# Altium schematic sheet MCU.SchDoc: Microcontroller
size A4; DrawnBy: A. Küllenberg; Revision: A; SheetNumber: 5; SheetTotal: 10
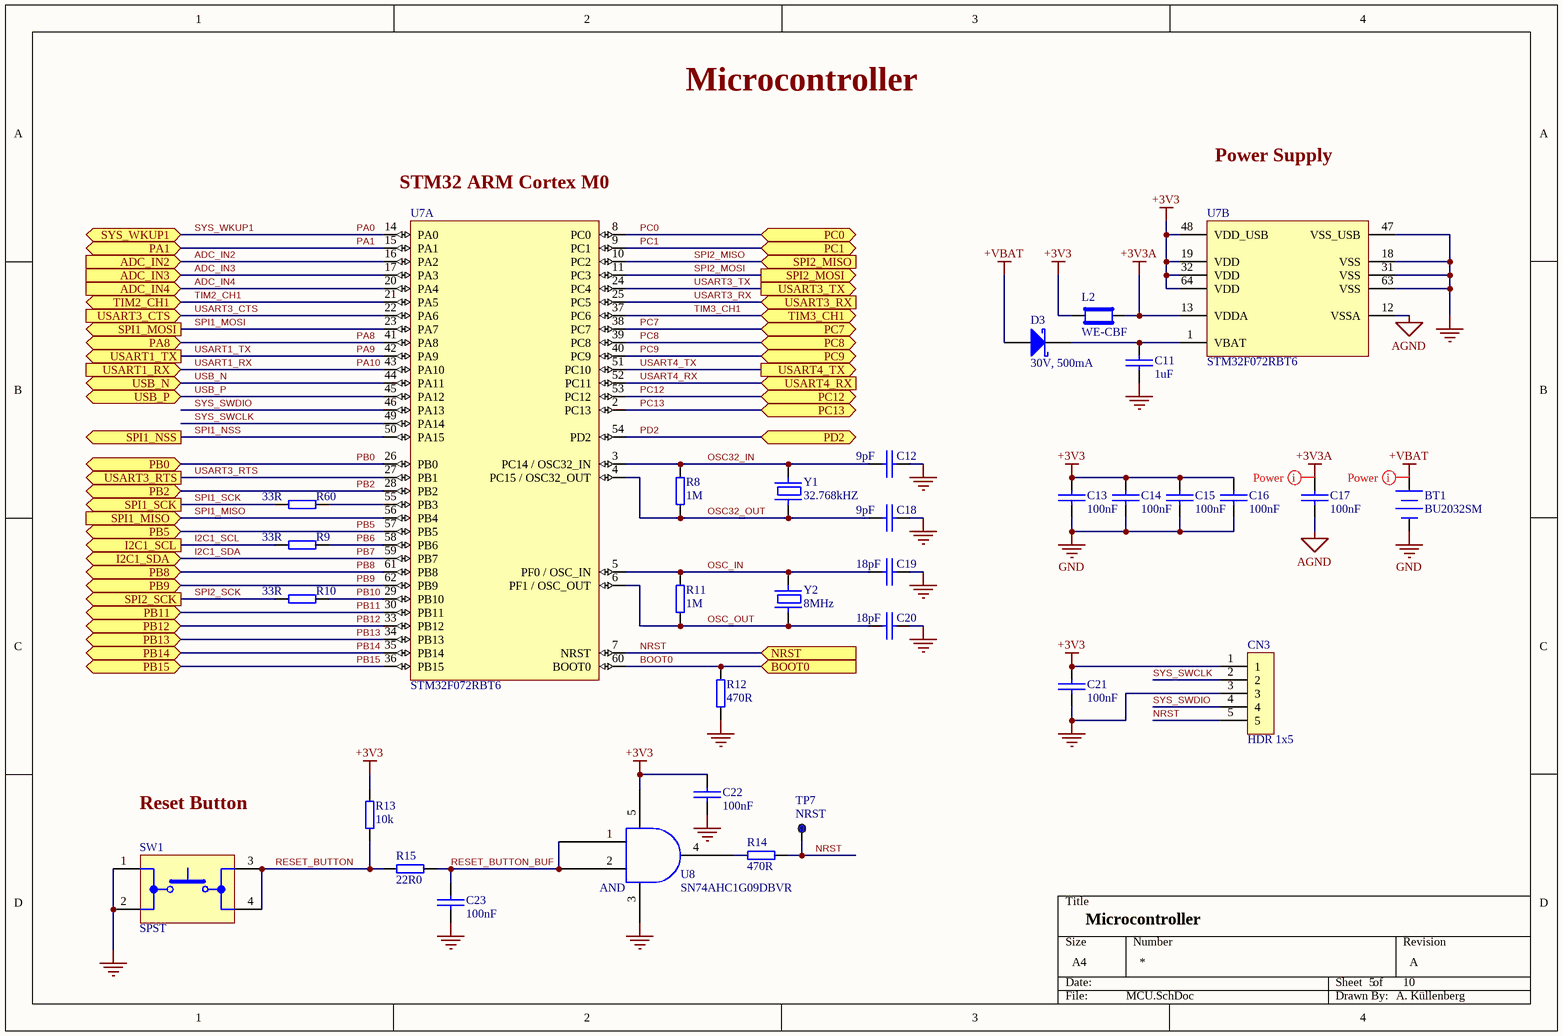
[diagram p0: MCU.SchDoc]

## Parts
BT1  BU2032SM  [BU2032SM]
C11  1uF  [C0603]
C12  9pF  [C0603]
C13  100nF  [C0603]
C14  100nF  [C0603]
C15  100nF  [C0603]
C16  100nF  [C0603]
C17  100nF  [C0603]
C18  9pF  [C0603]
C19  18pF  [C0603]
C20  18pF  [C0603]
C21  100nF  [C0603]
C22  100nF  [C0603]
C23  100nF  [C0603]
CN3  HDR 1x5  [PREC005SAAN-RC]
D3  30V, 500mA  [SOD523_N]
L2  WE-CBF  [L0603]
R8  1M  [R0603]
R9  33R  [R0402]
R10  33R  [R0402]
R11  1M  [R0603]
R12  470R  [R0402]
R13  10k  [R0603]
R14  470R  [R0603]
R15  22R0  [R0603]
R60  33R  [R0402]
SW1  SPST  [1825910-6]
TP7  NRST  [TP_1mm]  (no BOM)
U7  STM32F072RBT6  [LQFP64]  (parts A,B of 2)
U8  SN74AHC1G09DBVR  [SOT23-5]
Y1  32.768kHZ  [ABS07AIG]
Y2  8MHz  [ABM7_v1_1_BIG]

## Ports
ADC_IN2 (in), ADC_IN3 (in), ADC_IN4 (in), BOOT0 (in), I2C1_SCL (out), I2C1_SDA (bidir), NRST (in), PA1 (bidir), PA8 (bidir), PB0 (bidir), PB2 (bidir), PB5 (bidir), PB8 (bidir), PB9 (bidir), PB11 (bidir), PB12 (bidir), PB13 (bidir), PB14 (bidir), PB15 (bidir), PC0 (bidir), PC1 (bidir), PC7 (bidir), PC8 (bidir), PC9 (bidir), PC12 (bidir), PC13 (bidir), PD2 (bidir), SPI1_MISO (in), SPI1_MOSI (out), SPI1_NSS (out), SPI1_SCK (out), SPI2_MISO (in), SPI2_MOSI (out), SPI2_SCK (out), SYS_WKUP1 (bidir), TIM2_CH1 (bidir), TIM3_CH1 (bidir), USART1_RX (in), USART1_TX (out), USART3_CTS (in), USART3_RTS (out), USART3_RX (in), USART3_TX (out), USART4_RX (in), USART4_TX (out), USB_N (bidir), USB_P (bidir)

## Nets
+3V3: C13.2 C14.2 C15.2 C16.2 C21.2 C22.2 CN3.1 L2.1 R13.2 U7.19(VDD) U7.32(VDD) U7.48(VDD_USB) U7.64(VDD) U8.5
+3V3A: C17.2 L2.2 U7.13(VDDA)
+VBAT: BT1.1(+) D3.1(A)
AGND: C17.1 U7.12(VSSA)
GND: BT1.2(-) C11.1 C12.2 C13.1 C14.1 C15.1 C16.1 C18.2 C19.2 C20.2 C21.1 C22.1 C23.1 CN3.3 R12.1 SW1.1 SW1.2 U7.18(VSS) U7.31(VSS) U7.47(VSS_USB) U7.63(VSS) U8.3
ADC_IN2: U7.16(PA2) ; port ADC_IN2
ADC_IN3: U7.17(PA3) ; port ADC_IN3
ADC_IN4: U7.20(PA4) ; port ADC_IN4
BOOT0: R12.2 U7.60(BOOT0) ; port BOOT0
I2C1_SCL: R9.1 ; port I2C1_SCL
I2C1_SDA: U7.59(PB7) ; port I2C1_SDA  [also labelled PB7]
NRST: CN3.5 R14.2 TP7.1 U7.7(NRST) ; port NRST
OSC32_IN: C12.1 R8.2 U7.3(PC14_/_OSC32_IN) Y1.2
OSC32_OUT: C18.1 R8.1 U7.4(PC15_/_OSC32_OUT) Y1.1
OSC_IN: C19.1 R11.2 U7.5(PF0_/_OSC_IN) Y2.2
OSC_OUT: C20.1 R11.1 U7.6(PF1_/_OSC_OUT) Y2.1
PA0: U7.14(PA0) ; port SYS_WKUP1  [also labelled SYS_WKUP1]
PA1: U7.15(PA1) ; port PA1
PA8: U7.41(PA8) ; port PA8
PA9: U7.42(PA9) ; port USART1_TX  [also labelled USART1_TX]
PA10: U7.43(PA10) ; port USART1_RX  [also labelled USART1_RX]
PB0: U7.26(PB0) ; port PB0
PB2: U7.28(PB2) ; port PB2
PB5: U7.57(PB5) ; port PB5
PB6: R9.2 U7.58(PB6)
PB8: U7.61(PB8) ; port PB8
PB9: U7.62(PB9) ; port PB9
PB10: R10.2 U7.29(PB10)
PB11: U7.30(PB11) ; port PB11
PB12: U7.33(PB12) ; port PB12
PB13: U7.34(PB13) ; port PB13
PB14: U7.35(PB14) ; port PB14
PB15: U7.36(PB15) ; port PB15
PC0: U7.8(PC0) ; port PC0
PC1: U7.9(PC1) ; port PC1
PC7: U7.38(PC7) ; port PC7
PC8: U7.39(PC8) ; port PC8
PC9: U7.40(PC9) ; port PC9
PC12: U7.53(PC12) ; port PC12
PC13: U7.2(PC13) ; port PC13
PD2: U7.54(PD2) ; port PD2
RESET_BUTTON: R13.1 R15.1 SW1.3 SW1.4
RESET_BUTTON_BUF: C23.2 R15.2 U8.1 U8.2
SPI1_MISO: U7.56(PB4) ; port SPI1_MISO
SPI1_MOSI: U7.23(PA7) ; port SPI1_MOSI
SPI1_NSS: U7.50(PA15) ; port SPI1_NSS
SPI1_SCK: R60.1 ; port SPI1_SCK
SPI2_MISO: U7.10(PC2) ; port SPI2_MISO
SPI2_MOSI: U7.11(PC3) ; port SPI2_MOSI
SPI2_SCK: R10.1 ; port SPI2_SCK
SYS_SWCLK: CN3.2 U7.49(PA14)
SYS_SWDIO: CN3.4 U7.46(PA13)
TIM2_CH1: U7.21(PA5) ; port TIM2_CH1
TIM3_CH1: U7.37(PC6) ; port TIM3_CH1
USART3_CTS: U7.22(PA6) ; port USART3_CTS
USART3_RTS: U7.27(PB1) ; port USART3_RTS
USART3_RX: U7.25(PC5) ; port USART3_RX
USART3_TX: U7.24(PC4) ; port USART3_TX
USART4_RX: U7.52(PC11) ; port USART4_RX
USART4_TX: U7.51(PC10) ; port USART4_TX
USB_N: U7.44(PA11) ; port USB_N
USB_P: U7.45(PA12) ; port USB_P
NetC11_2: C11.2 D3.2(K) U7.1(VBAT)
NetR14_1: R14.1 U8.4
NetR60_2: R60.2 U7.55(PB3)

## Layout directives
net class Power: +3V3A, +VBAT

## Notes on the sheet
- Microcontroller
- Power Supply
- (near U7) STM32 ARM Cortex M0
- Reset Button
- (in symbol SN74AHC1G09DBVR) AND

## Library data of the parts
BT1 = BU2032SM-BT-GTR: HOLDER CR2032 GOLD LEADS SMD; Manufacturer: MPD (Memory Protection Devices); Battery Type, Function: Coin Cell, Holder; Style: Holder (Open); Battery Cell Size: Coin, 20.0mm; Number of Cells: 1; Battery Series: 2032; Published: 24-Mar-1999; LatestRevisionDate: 17-Jul-2002; LatestRevisionNote: Re-released for DXP Platform.; PackageReference: BAT-2; Publisher: Altium Limited; PackageDescription: Battery; 2 Leads; Part Number: BU2032SM-BT-GTR; Value: BU2032SM; Supplier 1: Digi-Key; Supplier Part Number 1: BU2032SM-BT-GCT-ND; Manufacturer Part Number: BU2032SM-BT-GTR; RoHS: RoHS Compliant; Category: Battery Products; Stock 1: 216128; Pricing 1: 1=0.71, 10=0.651, 100=0.5914 (EUR); Part Status: Active; Mounting Type: PCB, Surface Mount; Termination Style: SMD (SMT) Tab; Height Above Board: 0.205" (5.20mm); Operating Temperature: -40°C ~ 280°C; ComponentLink1URL: http://www.memoryprotectiondevices.com/datasheets/BU2032SM-BT-GTR-datasheet.pdf; ComponentLink1Description: http://www.memoryprotectiondevices.com/datasheets/BU2032SM-BT-GTR-datasheet.pdf
C11 = GCM188R71E105KA64D: CAP CER 1UF 25V X7R 0603; Manufacturer: Murata Electronics North America; Capacitance: 1µF; Tolerance: ±10%; Part Number: GCM188R71E105KA64D; Value: 1uF; Supplier 1: Digi-Key; Supplier Part Number 1: 490-10673-1-ND; Manufacturer Part Number: GCM188R71E105KA64D; RoHS: RoHS Compliant; Category: Capacitors; Stock 1: 53908; Pricing 1: 1=0.19, 10=0.13, 50=0.0748, 100=0.0617, 250=0.05196, 500=0.04352, 1000=0.03572 (EUR); Packaging: Cut Tape (CT); Voltage - Rated: 25V; Temperature Coefficient: X7R; Mounting Type: Surface Mount, MLCC; Operating Temperature: -55°C ~ 125°C; Applications: Automotive; Ratings: AEC-Q200; Package / Case: 0603 (1608 Metric); Size / Dimension: 0.063" L x 0.031" W (1.60mm x 0.80mm); Height - Seated (Max): -; Thickness (Max): 0.035" (0.90mm); Lead Spacing: -; Features: -; Lead Style: -; ComponentLink1URL: http://www.murata.com/~/media/webrenewal/support/library/catalog/products/capacitor/mlcc/c03e.ashx; ComponentLink1Description: http://www.murata.com/~/media/webrenewal/support/library/catalog/products/capacitor/mlcc/c03e.ashx
C12 C18 = CL10C090DB8NNNC: CAP CER 9PF 50V NP0 0603; Manufacturer: Samsung Electro-Mechanics America, Inc.; Tolerance: ±0.5pF; Temperature Coefficient: C0G, NP0; Part Number: CL10C090DB8NNNC; Value: 9pF; Supplier 1: Digi-Key; Supplier Part Number 1: 1276-2143-1-ND; Manufacturer Part Number: CL10C090DB8NNNC; RoHS: RoHS Compliant; Category: Capacitors; Stock 1: 4204; Pricing 1: 1=0.09, 10=0.034, 25=0.0244, 50=0.0184, 100=0.015, 250=0.01256, 500=0.01072, 1000=0.00842 (EUR); Packaging: Cut Tape (CT); Capacitance: 9pF; Voltage - Rated: 50V; Mounting Type: Surface Mount, MLCC; Operating Temperature: -55°C ~ 125°C; Applications: General Purpose; Ratings: -; Package / Case: 0603 (1608 Metric); Size / Dimension: 0.063" L x 0.031" W (1.60mm x 0.80mm); Height - Seated (Max): -; Thickness (Max): 0.035" (0.90mm); Lead Spacing: -; Features: -; Lead Style: -; ComponentLink1URL: http://www.samsungsem.com/kr/support/product-search/mlcc/__icsFiles/afieldfile/2016/08/18/S_CL10C090DB8NNNC.pdf; ComponentLink1Description: http://www.samsungsem.com/kr/support/product-search/mlcc/__icsFiles/afieldfile/2016/08/18/S_CL10C090DB8NNNC.pdf; Part Status: Active
C13-C17 C21-C23 = C0603C104K5RACTU: CAP CER 0.1UF 50V X7R 0603; Manufacturer: Kemet; Capacitance: 0.10µF; Tolerance: ±10%; Part Number: C0603C104K5RACTU; Value: 100nF; Supplier 1: Digi-Key; Supplier Part Number 1: 399-5089-1-ND; Manufacturer Part Number: C0603C104K5RACTU; RoHS: RoHS Compliant; Category: Capacitors; Stock 1: 1628757; Pricing 1: 1=0.09, 10=0.037, 50=0.0198, 100=0.0167, 250=0.01372, 500=0.01174, 1000=0.00914 (EUR); Packaging: Cut Tape (CT); Voltage - Rated: 50V; Temperature Coefficient: X7R; Mounting Type: Surface Mount, MLCC; Operating Temperature: -55°C ~ 125°C; Applications: General Purpose; Ratings: -; Package / Case: 0603 (1608 Metric); Size / Dimension: 0.063" L x 0.031" W (1.60mm x 0.80mm); Height - Seated (Max): -; Thickness (Max): 0.034" (0.87mm); Lead Spacing: -; Features: -; Lead Style: -; ComponentLink1URL: http://www.kemet.com/docfinder?Partnumber=C0603C104K5RACTU; ComponentLink1Description: http://www.kemet.com/docfinder?Partnumber=C0603C104K5RACTU
C19 C20 = CL10C180JB8NNNC: CAP CER 18PF 50V NP0 0603; Manufacturer: Samsung Electro-Mechanics America, Inc.; Tolerance: ±5%; Temperature Coefficient: C0G, NP0; Part Number: CL10C180JB8NNNC; Value: 18pF; Supplier 1: Digi-Key; Supplier Part Number 1: 1276-1089-1-ND; Manufacturer Part Number: CL10C180JB8NNNC; RoHS: RoHS Compliant; Category: Capacitors; Stock 1: 270357; Pricing 1: 1=0.09, 10=0.027, 25=0.02, 50=0.015, 100=0.0122, 250=0.01016, 500=0.00866, 1000=0.00682 (EUR); Packaging: Cut Tape (CT); Capacitance: 18pF; Voltage - Rated: 50V; Mounting Type: Surface Mount, MLCC; Operating Temperature: -55°C ~ 125°C; Applications: General Purpose; Ratings: -; Package / Case: 0603 (1608 Metric); Size / Dimension: 0.063" L x 0.031" W (1.60mm x 0.80mm); Height - Seated (Max): -; Thickness (Max): 0.035" (0.90mm); Lead Spacing: -; Features: -; Lead Style: -; ComponentLink1URL: http://www.samsungsem.com/kr/support/product-search/mlcc/__icsFiles/afieldfile/2016/08/18/S_CL10C180JB8NNNC.pdf; ComponentLink1Description: http://www.samsungsem.com/kr/support/product-search/mlcc/__icsFiles/afieldfile/2016/08/18/S_CL10C180JB8NNNC.pdf; Part Status: Active
CN3 = PREC005SAAN-RC: CONN HEADER .100" SNGL STR 5POS; Manufacturer: Sullins Connector Solutions; Connector Type: Header, Breakaway; Number of Positions: 5; Number of Positions Loaded: All; Current Rating: 3A per Contact; Pitch - Mating: 0.100" (2.54mm); Shrouding: Unshrouded; Contact Length - Mating: 0.230" (5.84mm); Style: Board to Board or Cable; Contact Length - Post: 0.120" (3.05mm); Overall Contact Length: 0.448" (11.39mm); Material Flammability Rating: UL94 V-0; Part Number: PREC005SAAN-RC; Value: HDR 1x5; Supplier 1: Digi-Key; Supplier Part Number 1: S1012EC-05-ND; Manufacturer Part Number: PREC005SAAN-RC; RoHS: RoHS Compliant; Category: Connectors, Interconnects; Stock 1: 1812; Pricing 1: 1=0.15, 10=0.137, 100=0.1124, 500=0.08882, 1000=0.07626, 5000=0.06957, 10000=0.06689 (EUR); Packaging: Bulk; Contact Type: Male Pin; Number of Rows: 1; Mounting Type: Through Hole; Termination: Solder; Fastening Type: -; Features: -; ComponentLink1URL: http://media.digikey.com/PDF/Data%20Sheets/Sullins%20PDFs/z%20RzCzzzSzzN-RC,%20ST,11635-B.pdf; ComponentLink1Description: http://media.digikey.com/PDF/Data%20Sheets/Sullins%20PDFs/z%20RzCzzzSzzN-RC,%20ST,11635-B.pdf; Voltage Rating: -; Contact Material: Brass; Operating Temperature: -40°C ~ 105°C; Part Status: Active; Row Spacing - Mating: -; Contact Finish - Mating: Tin; Contact Finish Thickness - Mating: -; Insulation Color: Black; Insulation Height: 0.098" (2.50mm); Contact Shape: Square; Ingress Protection: -; Contact Finish - Post: Tin; Insulation Material: Polybutylene Terephthalate (PBT); Mated Stacking Heights: -; Contact Finish Thickness - Post: -; Applications: -
D3 = BAS 3005B-02V H6327: DIODE SCHOTTKY 30V 500MA SC79-2; Manufacturer: Infineon Technologies; Current - Reverse Leakage @ Vr: 25µA @ 30V; Voltage - Forward (Vf) (Max) @ If: 620mV @ 500mA; Current - Average Rectified (Io): 500mA (DC); Speed: Fast Recovery =< 500ns, > 200mA (Io); Capacitance @ Vr, F: 10pF @ 5V, 1MHz; Part Number: BAS 3005B-02V H6327; Value: 30V, 500mA; Supplier 1: Digi-Key; Supplier Part Number 1: BAS 3005B-02V H6327CT-ND; Manufacturer Part Number: BAS 3005B-02V H6327; RoHS: RoHS Compliant; Category: Discrete Semiconductor Products; Stock 1: 33141; Pricing 1: 1=0.34, 10=0.26, 100=0.1619, 500=0.11066, 1000=0.08507 (EUR); Packaging: Cut Tape (CT); Mounting Type: Surface Mount; Package / Case: SC-79, SOD-523; Supplier Device Package: PG-SC79-2; ComponentLink1URL: http://www.infineon.com/dgdl/Infineon-BAS3005B-DS-v01_01-en.pdf?fileId=db3a30432d9b3066012db880a14b0bc1; ComponentLink1Description: http://www.infineon.com/dgdl/Infineon-BAS3005B-DS-v01_01-en.pdf?fileId=db3a30432d9b3066012db880a14b0bc1; Diode Type: Schottky; Voltage - DC Reverse (Vr) (Max): 30V; Reverse Recovery Time (trr): -; Operating Temperature - Junction: -55°C ~ 125°C
L2 = 742792651: FERRITE BEAD 600 OHM 0603 1LN; Manufacturer: Wurth Electronics Inc.; Filter Type: Signal Line; Number of Lines: 1; Impedance @ Frequency: 600 Ohm @ 100MHz; Current Rating (Max): 1A; DC Resistance (DCR) (Max): 200 mOhm; Part Number: 742792651; Value: WE-CBF; Supplier 1: Digi-Key; Supplier Part Number 1: 732-1593-1-ND; Manufacturer Part Number: 742792651; RoHS: RoHS Compliant; Category: Filters; Stock 1: 99870; Pricing 1: 1=0.22, 10=0.185, 50=0.1806, 100=0.1667, 1000=0.15164 (EUR); Packaging: Cut Tape (CT); Part Status: Active; Ratings: -; Operating Temperature: -55°C ~ 125°C; Package / Case: 0603 (1608 Metric); Mounting Type: Surface Mount; Height (Max): 0.039" (1.00mm); Size / Dimension: 0.063" L x 0.031" W (1.60mm x 0.80mm); ComponentLink1URL: http://katalog.we-online.de/pbs/datasheet/742792651.pdf; ComponentLink1Description: http://katalog.we-online.de/pbs/datasheet/742792651.pdf
R8 R11 = RC0603FR-071ML: RES SMD 1M OHM 1% 1/10W 0603; Manufacturer: Yageo; Power (Watts): 0.1W, 1/10W; Temperature Coefficient: ±100ppm/°C; Part Number: RC0603FR-071ML; Value: 1M; Manufacturer Part Number: RC0603FR-071ML; RoHS: RoHS Compliant; Category: Resistors; Stock 1: 3055845; Pricing 1: 1=0.09, 10=0.012, 25=0.0088, 50=0.0066, 100=0.0049, 250=0.00372, 500=0.00298, 1000=0.0022 (EUR); Packaging: Cut Tape (CT); Resistance (Ohms): 1M; Tolerance: ±1%; Composition: Thick Film; Features: Moisture Resistant; Operating Temperature: -55°C ~ 155°C; Package / Case: 0603 (1608 Metric); Supplier Device Package: 0603; Size / Dimension: 0.063" L x 0.031" W (1.60mm x 0.80mm); ComponentLink1URL: http://www.yageo.com/documents/recent/PYu-RC_Group_51_RoHS_L_7.pdf; ComponentLink1Description: http://www.yageo.com/documents/recent/PYu-RC_Group_51_RoHS_L_7.pdf; Supplier 1: Digi-Key; Supplier Part Number 1: 311-1.00MHRCT-ND; Height - Seated (Max): 0.022" (0.55mm); Part Status: Active; Failure Rate: -
R9 R10 R60 = RC0402FR-0733RL: RES SMD 33 OHM 1% 1/16W 0402; Manufacturer: Yageo; Resistance (Ohms): 33; Power (Watts): 0.063W, 1/16W; Temperature Coefficient: ±100ppm/°C; Part Number: RC0402FR-0733RL; Value: 33R; Manufacturer Part Number: RC0402FR-0733RL; RoHS: RoHS Compliant; Category: Resistors; Stock 1: 1076015; Pricing 1: 1=0.09, 10=0.012, 100=0.005, 1000=0.00222, 2500=0.00193, 5000=0.00159 (EUR); Packaging: Cut Tape (CT); Tolerance: ±1%; Composition: Thick Film; Features: Moisture Resistant; Operating Temperature: -55°C ~ 155°C; Package / Case: 0402 (1005 Metric); Supplier Device Package: 0402; Size / Dimension: 0.039" L x 0.020" W (1.00mm x 0.50mm); ComponentLink1URL: http://www.yageo.com/documents/recent/PYu-RC_Group_51_RoHS_L_7.pdf; ComponentLink1Description: http://www.yageo.com/documents/recent/PYu-RC_Group_51_RoHS_L_7.pdf; Supplier 1: Digi-Key; Supplier Part Number 1: 311-33.0LRCT-ND; Height - Seated (Max): 0.016" (0.40mm); Part Status: Active; Failure Rate: -
R12 = RC0402FR-07470RL: RES SMD 470 OHM 1% 1/16W 0402; Manufacturer: Yageo; Resistance (Ohms): 470; Power (Watts): 0.063W, 1/16W; Temperature Coefficient: ±100ppm/°C; Part Number: RC0402FR-07470RL; Value: 470R; Manufacturer Part Number: RC0402FR-07470RL; RoHS: RoHS Compliant; Category: Resistors; Stock 1: 625757; Pricing 1: 1=0.09, 10=0.012, 100=0.005, 1000=0.00222, 2500=0.00193, 5000=0.00159 (EUR); Packaging: Cut Tape (CT); Tolerance: ±1%; Composition: Thick Film; Features: Moisture Resistant; Operating Temperature: -55°C ~ 155°C; Package / Case: 0402 (1005 Metric); Supplier Device Package: 0402; Size / Dimension: 0.039" L x 0.020" W (1.00mm x 0.50mm); ComponentLink1URL: http://www.yageo.com/documents/recent/PYu-RC_Group_51_RoHS_L_7.pdf; ComponentLink1Description: http://www.yageo.com/documents/recent/PYu-RC_Group_51_RoHS_L_7.pdf; Supplier 1: Digi-Key; Supplier Part Number 1: 311-470LRCT-ND; Height - Seated (Max): 0.016" (0.40mm); Part Status: Active; Failure Rate: -
R13 = RC0603FR-0710KL: RES SMD 10K OHM 1% 1/10W 0603; Manufacturer: Yageo; Power (Watts): 0.1W, 1/10W; Temperature Coefficient: ±100ppm/°C; Part Number: RC0603FR-0710KL; Value: 10k; Manufacturer Part Number: RC0603FR-0710KL; RoHS: RoHS Compliant; Category: Resistors; Stock 1: 14298796; Pricing 1: 1=0.09, 10=0.012, 25=0.0088, 50=0.007, 100=0.0051, 250=0.00388, 500=0.0031, 1000=0.00229 (EUR); Packaging: Cut Tape (CT); Resistance (Ohms): 10k; Tolerance: ±1%; Composition: Thick Film; Features: Moisture Resistant; Operating Temperature: -55°C ~ 155°C; Package / Case: 0603 (1608 Metric); Supplier Device Package: 0603; Size / Dimension: 0.063" L x 0.031" W (1.60mm x 0.80mm); ComponentLink1URL: http://www.yageo.com/documents/recent/PYu-RC_Group_51_RoHS_L_7.pdf; ComponentLink1Description: http://www.yageo.com/documents/recent/PYu-RC_Group_51_RoHS_L_7.pdf; Supplier 1: Digi-Key; Supplier Part Number 1: 311-10.0KHRCT-ND; Height - Seated (Max): 0.022" (0.55mm); Part Status: Active; Failure Rate: -
R14 = 470R: RES SMD 470 OHM 1% 1/10W 0603; Manufacturer: Yageo; Manufacturer Part Number: RC0603FR-07470RL; Resistance (Ohms): 470; Power (Watts): 0.1W, 1/10W; Temperature Coefficient: ±100ppm/°C; Part Number: 470R; Value: 470R; RoHS: RoHS Compliant; Category: Resistors; Stock 1: 2060115; Pricing 1: 1=0.09, 10=0.012, 25=0.0088, 50=0.0066, 100=0.0049, 250=0.00372, 500=0.00298, 1000=0.0022 (EUR); Packaging: Cut Tape (CT); Tolerance: ±1%; Composition: Thick Film; Features: Moisture Resistant; Operating Temperature: -55°C ~ 155°C; Package / Case: 0603 (1608 Metric); Supplier Device Package: 0603; Size / Dimension: 0.063" L x 0.031" W (1.60mm x 0.80mm); ComponentLink1URL: http://www.yageo.com/documents/recent/PYu-RC_Group_51_RoHS_L_7.pdf; ComponentLink1Description: http://www.yageo.com/documents/recent/PYu-RC_Group_51_RoHS_L_7.pdf; Supplier 1: Digi-Key; Supplier Part Number 1: 311-470HRCT-ND; Height - Seated (Max): 0.022" (0.55mm); Part Status: Active; Failure Rate: -
R15 = RC0603FR-0722RL: RES SMD 22 OHM 1% 1/10W 0603; Manufacturer: Yageo; Resistance (Ohms): 22; Power (Watts): 0.1W, 1/10W; Temperature Coefficient: ±100ppm/°C; Part Number: RC0603FR-0722RL; Value: 22R0; Manufacturer Part Number: RC0603FR-0722RL; RoHS: RoHS Compliant; Category: Resistors; Stock 1: 1868929; Pricing 1: 1=0.09, 10=0.012, 25=0.0088, 50=0.0066, 100=0.0049, 250=0.00372, 500=0.00298, 1000=0.0022 (EUR); Packaging: Cut Tape (CT); Tolerance: ±1%; Composition: Thick Film; Features: Moisture Resistant; Operating Temperature: -55°C ~ 155°C; Package / Case: 0603 (1608 Metric); Supplier Device Package: 0603; Size / Dimension: 0.063" L x 0.031" W (1.60mm x 0.80mm); ComponentLink1URL: http://www.yageo.com/documents/recent/PYu-RC_Group_51_RoHS_L_7.pdf; ComponentLink1Description: http://www.yageo.com/documents/recent/PYu-RC_Group_51_RoHS_L_7.pdf; Supplier 1: Digi-Key; Supplier Part Number 1: 311-22.0HRCT-ND; Height - Seated (Max): 0.022" (0.55mm); Part Status: Active; Failure Rate: -
SW1 = 1825910-6: SWITCH TACTILE SPST-NO 0.05A 24V; Manufacturer: TE Connectivity ALCOSWITCH Switches; Switch Function: Off-Mom; Contact Rating @ Voltage: 0.05A @ 24VDC; Actuator Type: Standard; Actuator Orientation: Top Actuated; Outline: 6.00mm x 6.00mm; Illumination: Non-Illuminated; Operating Force: 160gf; Actuator Material: Polybutylene Terephthalate (PBT); Switch Travel: 0.25mm; Mechanical Life: 100,000 Cycles; Actuator Height off PCB, Vertical: 5.00mm; Part Number: 1825910-6; Value: SPST; Supplier 1: Digi-Key; Supplier Part Number 1: 450-1650-ND; Manufacturer Part Number: 1825910-6; RoHS: RoHS Compliant; Category: Switches; Stock 1: 36200; Pricing 1: 1=0.09, 10=0.083, 25=0.0808, 50=0.0778, 100=0.0734, 250=0.06912, 500=0.06624, 1000=0.05041, 5000=0.04177 (EUR); Packaging: Bulk; Circuit: SPST-NO; Mounting Type: Through Hole; Termination Style: PC Pin; Illumination Voltage (Nominal): -; Illumination Type, Color: -; Ingress Protection: -; Features: -; Operating Temperature: -35°C ~ 85°C; ComponentLink1URL: http://www.te.com/commerce/DocumentDelivery/DDEController?Action=srchrtrv&DocNm=1825910&DocType=Customer+Drawing&DocLang=English; ComponentLink1Description: http://www.te.com/commerce/DocumentDelivery/DDEController?Action=srchrtrv&DocNm=1825910&DocType=Customer+Drawing&DocLang=English; Part Status: Active; Actuator Length, Right Angle: -
TP7 = TP: Value: TP; Part Number: TP
U7 = STM32F072RBT6: IC MCU 32BIT 128KB FLASH 64LQFP; Manufacturer: STMicroelectronics; Core Processor: ARM® Cortex®-M0; Core Size: 32-Bit; Speed: 48MHz; Connectivity: CAN, HDMI-CEC, I²C, IrDA, LIN, SPI, UART/USART, USB; Peripherals: DMA, I²S, POR, PWM, WDT; Number of I/O: 51; Program Memory Size: 128KB (128K x 8); RAM Size: 16K x 8; Voltage - Supply (Vcc/Vdd): 1.65 V ~ 3.6 V; Data Converters: A/D 19x12b, D/A 1x12b; Oscillator Type: Internal; Part Number: STM32F072RBT6; Value: STM32F072RBT6; Manufacturer Part Number: STM32F072RBT6; RoHS: RoHS Compliant; Category: Integrated Circuits (ICs); Stock 1: 1445; Pricing 1: 1=3.71, 10=3.334, 100=2.7317, 500=2.32548, 1000=1.96125 (EUR); Packaging: Tray; Program Memory Type: FLASH; EEPROM Size: -; Operating Temperature: -40°C ~ 85°C (TA); Package / Case: 64-LQFP; Supplier Device Package: 64-LQFP (10x10); ComponentLink1URL: http://www.st.com/content/ccc/resource/technical/document/datasheet/cd/46/43/83/22/d3/40/c8/DM00090510.pdf/files/DM00090510.pdf/jcr:content/translations/en.DM00090510.pdf; ComponentLink1Description: http://www.st.com/content/ccc/resource/technical/document/datasheet/cd/46/43/83/22/d3/40/c8/DM00090510.pdf/files/DM00090510.pdf/jcr:content/translations/en.DM00090510.pdf; Supplier 1: Digi-Key; Supplier Part Number 1: 497-14644-ND; Part Status: Active
U8 = SN74AHC1G09DBVR: IC GATE AND 1CH 2-INP SOT-23-5; Manufacturer: Texas Instruments; Logic Type: AND Gate; Number of Circuits: 1; Number of Inputs: 2; Voltage - Supply: 2 V ~ 5.5 V; Current - Quiescent (Max): 1µA; Current - Output High, Low: -, 8mA; Logic Level - Low: 0.5 V ~ 1.65 V; Logic Level - High: 1.5 V ~ 3.85 V; Max Propagation Delay @ V, Max CL: 7.5ns @ 5V, 50pF; Part Number: SN74AHC1G09DBVR; Value: SN74AHC1G09DBVR; Supplier 1: Digi-Key; Supplier Part Number 1: 296-29202-1-ND; Manufacturer Part Number: SN74AHC1G09DBVR; RoHS: RoHS Compliant; Category: Integrated Circuits (ICs); Stock 1: 17009; Pricing 1: 1=0.4, 10=0.296, 100=0.1847, 500=0.1264, 1000=0.09723 (EUR); Packaging: Cut Tape (CT); Features: Open Drain; Operating Temperature: -55°C ~ 125°C; Mounting Type: Surface Mount; Supplier Device Package: SOT-23-5; Package / Case: SC-74A, SOT-753; ComponentLink1URL: http://www.ti.com/lit/ds/symlink/sn74ahc1g09.pdf; ComponentLink1Description: http://www.ti.com/lit/ds/symlink/sn74ahc1g09.pdf; Part Status: Active
Y1 = ABS07AIG-32.768KHZ-9-1-T: CRYSTAL 32.768KHZ 9PF SMD; Manufacturer: Abracon LLC; Frequency Tolerance: ±10ppm; ESR (Equivalent Series Resistance): 70 kOhm; Operating Mode: Fundamental; Part Number: ABS07AIG-32.768KHZ-9-1-T; Value: 32.768kHZ; Supplier 1: Digi-Key; Supplier Part Number 1: 535-13353-1-ND; Manufacturer Part Number: ABS07AIG-32.768KHZ-9-1-T; RoHS: RoHS Compliant; Category: Crystals, Oscillators, Resonators; Stock 1: 5871; Pricing 1: 1=0.7, 10=0.618, 50=0.5782, 100=0.511, 500=0.4841, 1000=0.40342 (EUR); Packaging: Cut Tape (CT); Part Status: Active; Type: kHz Crystal (Tuning Fork); Frequency: 32.768kHz; Frequency Stability: -; Load Capacitance: 9pF; Operating Temperature: -40°C ~ 125°C; Ratings: AEC-Q200; Mounting Type: Surface Mount; Package / Case: 2-SMD, No Lead; Size / Dimension: 0.126" L x 0.059" W (3.20mm x 1.50mm); Height - Seated (Max): 0.035" (0.90mm); ComponentLink1URL: http://www.abracon.com/AIGcrystals/ABS07AIG.pdf; ComponentLink1Description: http://www.abracon.com/AIGcrystals/ABS07AIG.pdf
Y2 = ABM7-8.000MHZ-D2Y-T: CRYSTAL 8.0000MHZ 18PF SMD; Manufacturer: Abracon LLC; Frequency Stability: ±30ppm; Frequency Tolerance: ±20ppm; ESR (Equivalent Series Resistance): 100 Ohm; Operating Mode: Fundamental; Part Number: ABM7-8.000MHZ-D2Y-T; Value: 8MHz; Supplier 1: Digi-Key; Supplier Part Number 1: 535-9831-1-ND; Manufacturer Part Number: ABM7-8.000MHZ-D2Y-T; RoHS: RoHS Compliant; Category: Crystals, Oscillators, Resonators; Stock 1: 127194; Pricing 1: 1=0.69, 10=0.571, 50=0.5142, 100=0.4569, 500=0.43406 (EUR); Packaging: Cut Tape (CT); Part Status: Active; Type: MHz Crystal; Frequency: 8MHz; Load Capacitance: 18pF; Operating Temperature: -40°C ~ 85°C; Ratings: -; Mounting Type: Surface Mount; Package / Case: 2-SMD, No Lead; Size / Dimension: 0.236" L x 0.138" W (6.00mm x 3.50mm); Height - Seated (Max): 0.055" (1.40mm); ComponentLink1URL: http://www.abracon.com/Resonators/abm7.pdf; ComponentLink1Description: http://www.abracon.com/Resonators/abm7.pdf